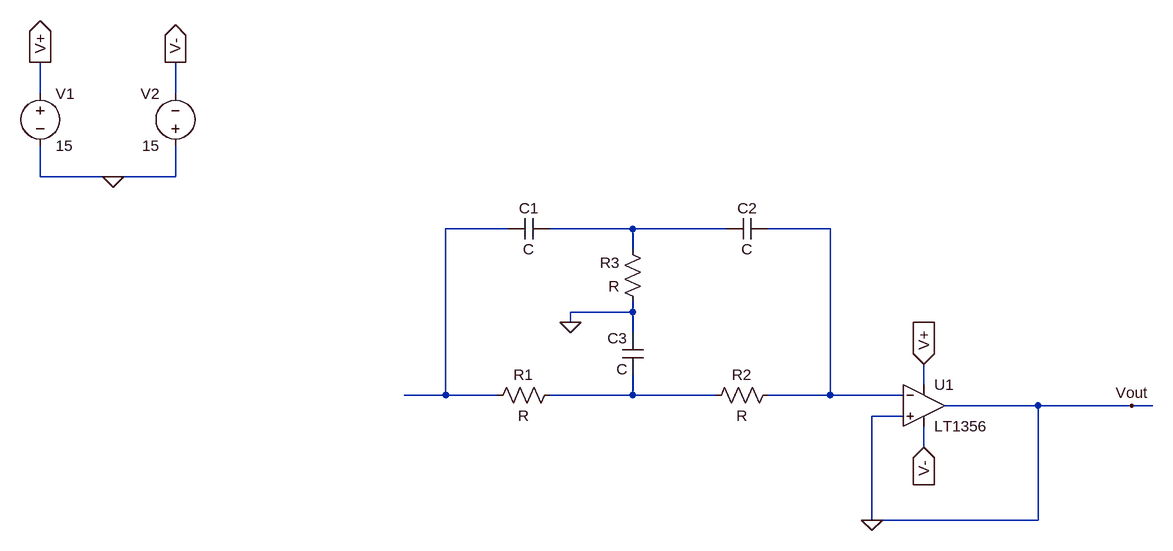
[diagram p0: schematic Draft1.asc]
Draft1.asc, the LTspice schematic file:
Version 4
SHEET 1 1036 680
WIRE -688 -240 -688 -288
WIRE -480 -240 -480 -288
WIRE -688 -112 -688 -160
WIRE -576 -112 -688 -112
WIRE -480 -112 -480 -160
WIRE -480 -112 -576 -112
WIRE 32 -32 -64 -32
WIRE 224 -32 96 -32
WIRE 368 -32 224 -32
WIRE 528 -32 432 -32
WIRE 224 0 224 -32
WIRE 224 96 224 80
WIRE 224 96 128 96
WIRE 128 112 128 96
WIRE 224 128 224 96
WIRE 672 208 672 176
WIRE -64 224 -64 -32
WIRE -64 224 -128 224
WIRE 16 224 -64 224
WIRE 224 224 224 192
WIRE 224 224 96 224
WIRE 352 224 224 224
WIRE 528 224 528 -32
WIRE 528 224 432 224
WIRE 640 224 528 224
WIRE 848 240 704 240
WIRE 992 240 848 240
WIRE 1024 240 992 240
WIRE 640 256 592 256
WIRE 672 304 672 272
WIRE 592 416 592 256
WIRE 848 416 848 240
WIRE 848 416 592 416
FLAG 128 112 0
FLAG -576 -112 0
FLAG -688 -288 V+
IOPIN -688 -288 Out
FLAG -480 -288 V-
IOPIN -480 -288 Out
FLAG 672 176 V+
IOPIN 672 176 In
FLAG 672 304 V-
IOPIN 672 304 In
FLAG 992 240 Vout
FLAG 592 416 0
SYMBOL res 112 208 R90
WINDOW 0 0 56 VBottom 2
WINDOW 3 32 56 VTop 2
SYMATTR InstName R1
SYMBOL res 448 208 R90
WINDOW 0 0 56 VBottom 2
WINDOW 3 32 56 VTop 2
SYMATTR InstName R2
SYMBOL res 240 96 R180
WINDOW 0 36 76 Left 2
WINDOW 3 36 40 Left 2
SYMATTR InstName R3
SYMBOL cap 96 -48 R90
WINDOW 0 0 32 VBottom 2
WINDOW 3 32 32 VTop 2
SYMATTR InstName C1
SYMBOL cap 432 -48 R90
WINDOW 0 0 32 VBottom 2
WINDOW 3 32 32 VTop 2
SYMATTR InstName C2
SYMBOL cap 240 192 R180
WINDOW 0 24 56 Left 2
WINDOW 3 24 8 Left 2
SYMATTR InstName C3
SYMBOL OpAmps\\LT1356 672 176 R0
SYMATTR InstName U1
SYMBOL voltage -688 -256 R0
WINDOW 123 0 0 Left 0
WINDOW 39 0 0 Left 0
SYMATTR InstName V1
SYMATTR Value 15
SYMBOL voltage -480 -144 R180
WINDOW 0 24 96 Left 2
WINDOW 3 24 16 Left 2
WINDOW 123 0 0 Left 0
WINDOW 39 0 0 Left 0
SYMATTR InstName V2
SYMATTR Value 15

The netlist it stands for:
* Draft1.asc
R1 N004 N001 R
R2 N003 N004 R
R3 0 N002 R
C1 N002 N001 C
C2 N003 N002 C
C3 N004 0 C
XU1 0 N003 V+ V- 0 LT1356  ; pins In+ In- V+ V- OUT
V1 V+ 0 15
V2 0 V- 15
.backanno
.end